# EAGLE design I2C-7313-cTc (EAGLE 7.7.0)

## Sheet 1 of 2
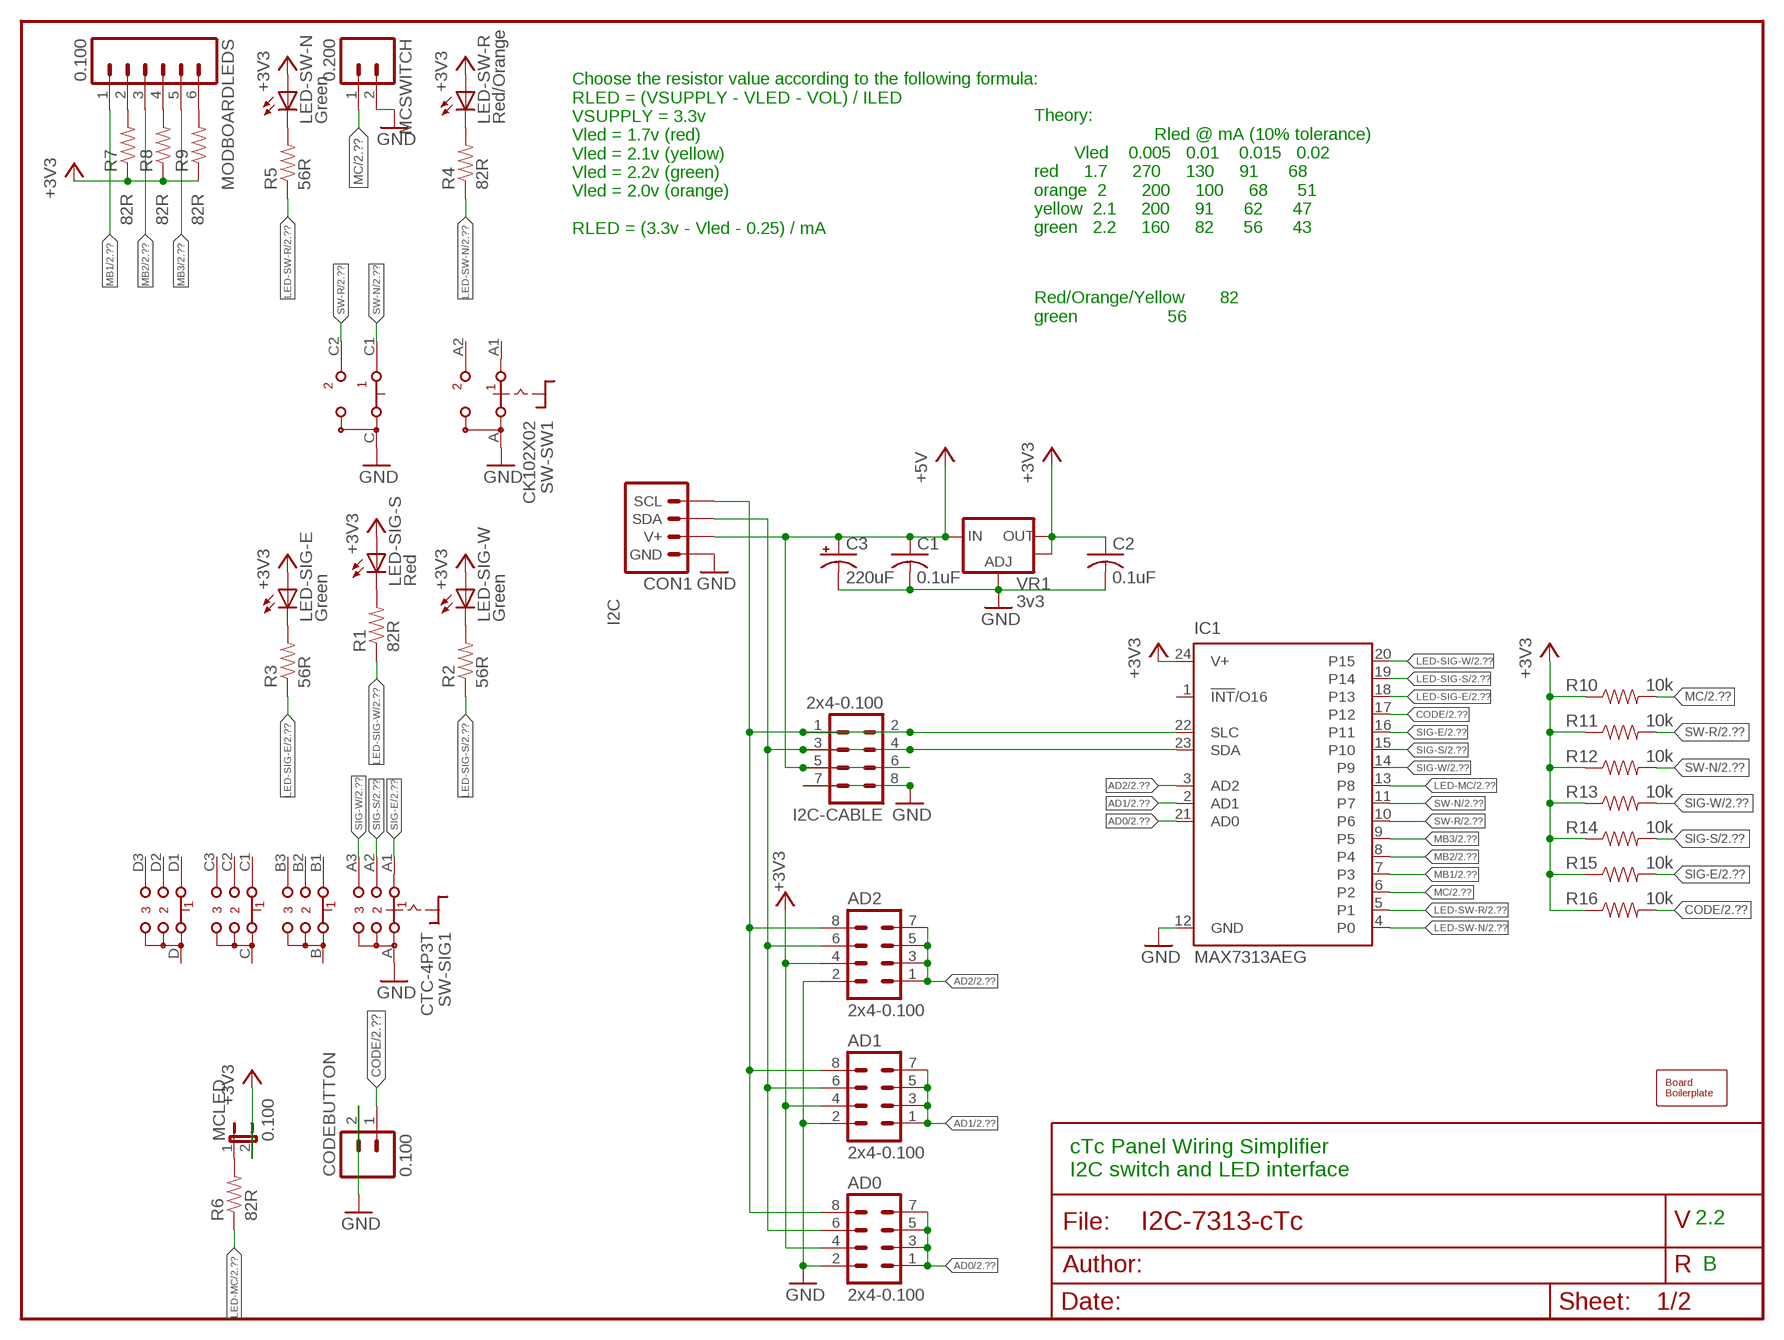
[diagram p0: schematic, sheet 1]

### Parts
AD0  2x4-0.100  MA04-2  [MA04-2]
AD1  2x4-0.100  MA04-2  [MA04-2]
AD2  2x4-0.100  MA04-2  [MA04-2]
BOARD1  BOARD  BOARD100X150X2-NOHOLES  [BOARD-SEEED10X15/2-NOHOLES]
C1  0.1uF  CAP0603  [0603-CAP]
C2  0.1uF  CAP0603  [0603-CAP]
C3  220uF  CAP-POL0810  [0810-CAP]
CODEBUTTON  0.100  CONNECTOR-M021X02-LOCK  [1X02_LOCK]
CON1  I2C  CONNECTOR-I2CLEFT  [I2C-L]
I2C-CABLE  2x4-0.100  MA04-2  [MA04-2]
IC1  MAX7313AEG  [QSOP24]
LED-SIG-E  Green  LEDLED3MM  [LED3MM]
LED-SIG-S  Red  LEDLED3MM  [LED3MM]
LED-SIG-W  Green  LEDLED3MM  [LED3MM]
LED-SW-N  Green  LEDLED3MM  [LED3MM]
LED-SW-R  Red/Orange  LEDLED3MM  [LED3MM]
MCLED  0.100  JUMPER-2PTH_LOCK  [1X02_LOCK]
MCSWITCH  0.200  CONNECTOR-M025MM-LOCK  [SCREWTERMINAL-5MM-2]
MODBOARDLEDS  0.100  CONNECTOR-M06LOCK_LONGPADS  [1X06_LOCK_LONGPADS]
R1  82R  R0603-RES  [0603-RES]
R2  56R  R0603-RES  [0603-RES]
R3  56R  R0603-RES  [0603-RES]
R4  82R  R0603-RES  [0603-RES]
R5  56R  R0603-RES  [0603-RES]
R6  82R  R0603-RES  [0603-RES]
R7  82R  R0603-RES  [0603-RES]
R8  82R  R0603-RES  [0603-RES]
R9  82R  R0603-RES  [0603-RES]
R10  10k  R0603-RES  [0603-RES]
R11  10k  R0603-RES  [0603-RES]
R12  10k  R0603-RES  [0603-RES]
R13  10k  R0603-RES  [0603-RES]
R14  10k  R0603-RES  [0603-RES]
R15  10k  R0603-RES  [0603-RES]
R16  10k  R0603-RES  [0603-RES]
SW-SIG1  CTC-4P3T  [CTC-4P3T]
SW-SW1  CK102X02  [CK102X02]
VR1  3v3  VREG_LM1117SOT223  [SOT223]

### Nets
+3V3: AD0.4 AD1.4 AD2.4 C2.1 IC1.24(V+) LED-SIG-E.A LED-SIG-S.A LED-SIG-W.A LED-SW-N.A LED-SW-R.A MCLED.2 R7.1 R8.1 R9.1 R10.1 R11.1 R12.1 R13.1 R14.1 R15.1 R16.1 VR1.2(OUT) VR1.4(OUT) ; also sheet 2
+5V: C1.1 C3.+ CON1.V+ CON1.V+@1(V+) I2C-CABLE.5 I2C-CABLE.6 VR1.3(IN) ; also sheet 2
AD0: AD0.1 AD0.3 AD0.5 AD0.7 IC1.21(AD0) ; also sheet 2
AD1: AD1.1 AD1.3 AD1.5 AD1.7 IC1.2(AD1) ; also sheet 2
AD2: AD2.1 AD2.3 AD2.5 AD2.7 IC1.3(AD2) ; also sheet 2
CODE: CODEBUTTON.1(A) IC1.17(P12) R16.2 ; also sheet 2
GND: AD0.2 AD1.2 AD2.2 C1.2 C2.2 C3.- CODEBUTTON.2(B) CON1.GND CON1.GND@1(GND) I2C-CABLE.7 I2C-CABLE.8 IC1.12(GND) MCSWITCH.2(B) SW-SIG1.A SW-SW1.A SW-SW1.C VR1.1(ADJ) ; also sheet 2
LED-MC: IC1.13(P8) R6.1 ; also sheet 2
LED-SIG-E: IC1.18(P13) R3.1 ; also sheet 2
LED-SIG-S: IC1.19(P14) R2.1 ; also sheet 2
LED-SIG-W: IC1.20(P15) R1.1 ; also sheet 2
LED-SW-N: IC1.4(P0) R4.1 ; also sheet 2
LED-SW-R: IC1.5(P1) R5.1 ; also sheet 2
MB1: IC1.7(P3) MODBOARDLEDS.1 ; also sheet 2
MB2: IC1.8(P4) MODBOARDLEDS.3 ; also sheet 2
MB3: IC1.9(P5) MODBOARDLEDS.5 ; also sheet 2
MC: IC1.6(P2) MCSWITCH.1(A) R10.2 ; also sheet 2
N$1: MCLED.1 R6.2
N$2: LED-SW-N.K(C) R5.2
N$3: LED-SW-R.K(C) R4.2
N$4: MODBOARDLEDS.2 R7.2
N$5: LED-SIG-E.K(C) R3.2
N$6: MODBOARDLEDS.4 R8.2
N$7: MODBOARDLEDS.6 R9.2
N$8: LED-SIG-W.K(C) R2.2
N$9: LED-SIG-S.K(C) R1.2
SCL: AD0.8 AD1.8 AD2.8 CON1.SCL CON1.SCL@1(SCL) I2C-CABLE.1 I2C-CABLE.2 IC1.22(SLC)
SDA: AD0.6 AD1.6 AD2.6 CON1.SDA CON1.SDA@1(SDA) I2C-CABLE.3 I2C-CABLE.4 IC1.23(SDA)
SIG-E: IC1.16(P11) R15.2 SW-SIG1.A1 ; also sheet 2
SIG-S: IC1.15(P10) R14.2 SW-SIG1.A2 ; also sheet 2
SIG-W: IC1.14(P9) R13.2 SW-SIG1.A3 ; also sheet 2
SW-N: IC1.11(P7) R12.2 SW-SW1.C1 ; also sheet 2
SW-R: IC1.10(P6) R11.2 SW-SW1.C2 ; also sheet 2
Unconnected: IC1.1(!INT!/O16) SW-SIG1.B SW-SIG1.B1 SW-SIG1.B2 SW-SIG1.B3 SW-SIG1.C SW-SIG1.C1 SW-SIG1.C2 SW-SIG1.C3 SW-SIG1.D SW-SIG1.D1 SW-SIG1.D2 SW-SIG1.D3 SW-SW1.A1 SW-SW1.A2

### Notes on the sheet
- Choose the resistor value according to the following formula: 
  RLED = (VSUPPLY - VLED - VOL) / ILED
  VSUPPLY = 3.3v
  Vled = 1.7v (red) 
  Vled = 2.1v (yellow)
  Vled = 2.2v (green)
  Vled = 2.0v (orange)
  
  RLED = (3.3v - Vled - 0.25) / mA
- Theory:
                          Rled @ mA (10% tolerance)     
          Vled    0.005   0.01    0.015   0.02
  red     1.7     270     130     91      68
  orange  2       200     100     68      51
  yellow  2.1     200     91      62      47
  green   2.2     160     82      56      43
- Red/Orange/Yellow       82    
  green                  56
- cTc Panel Wiring Simplifier
  I2C switch and LED interface
- 2.2
- B

## Sheet 2 of 2
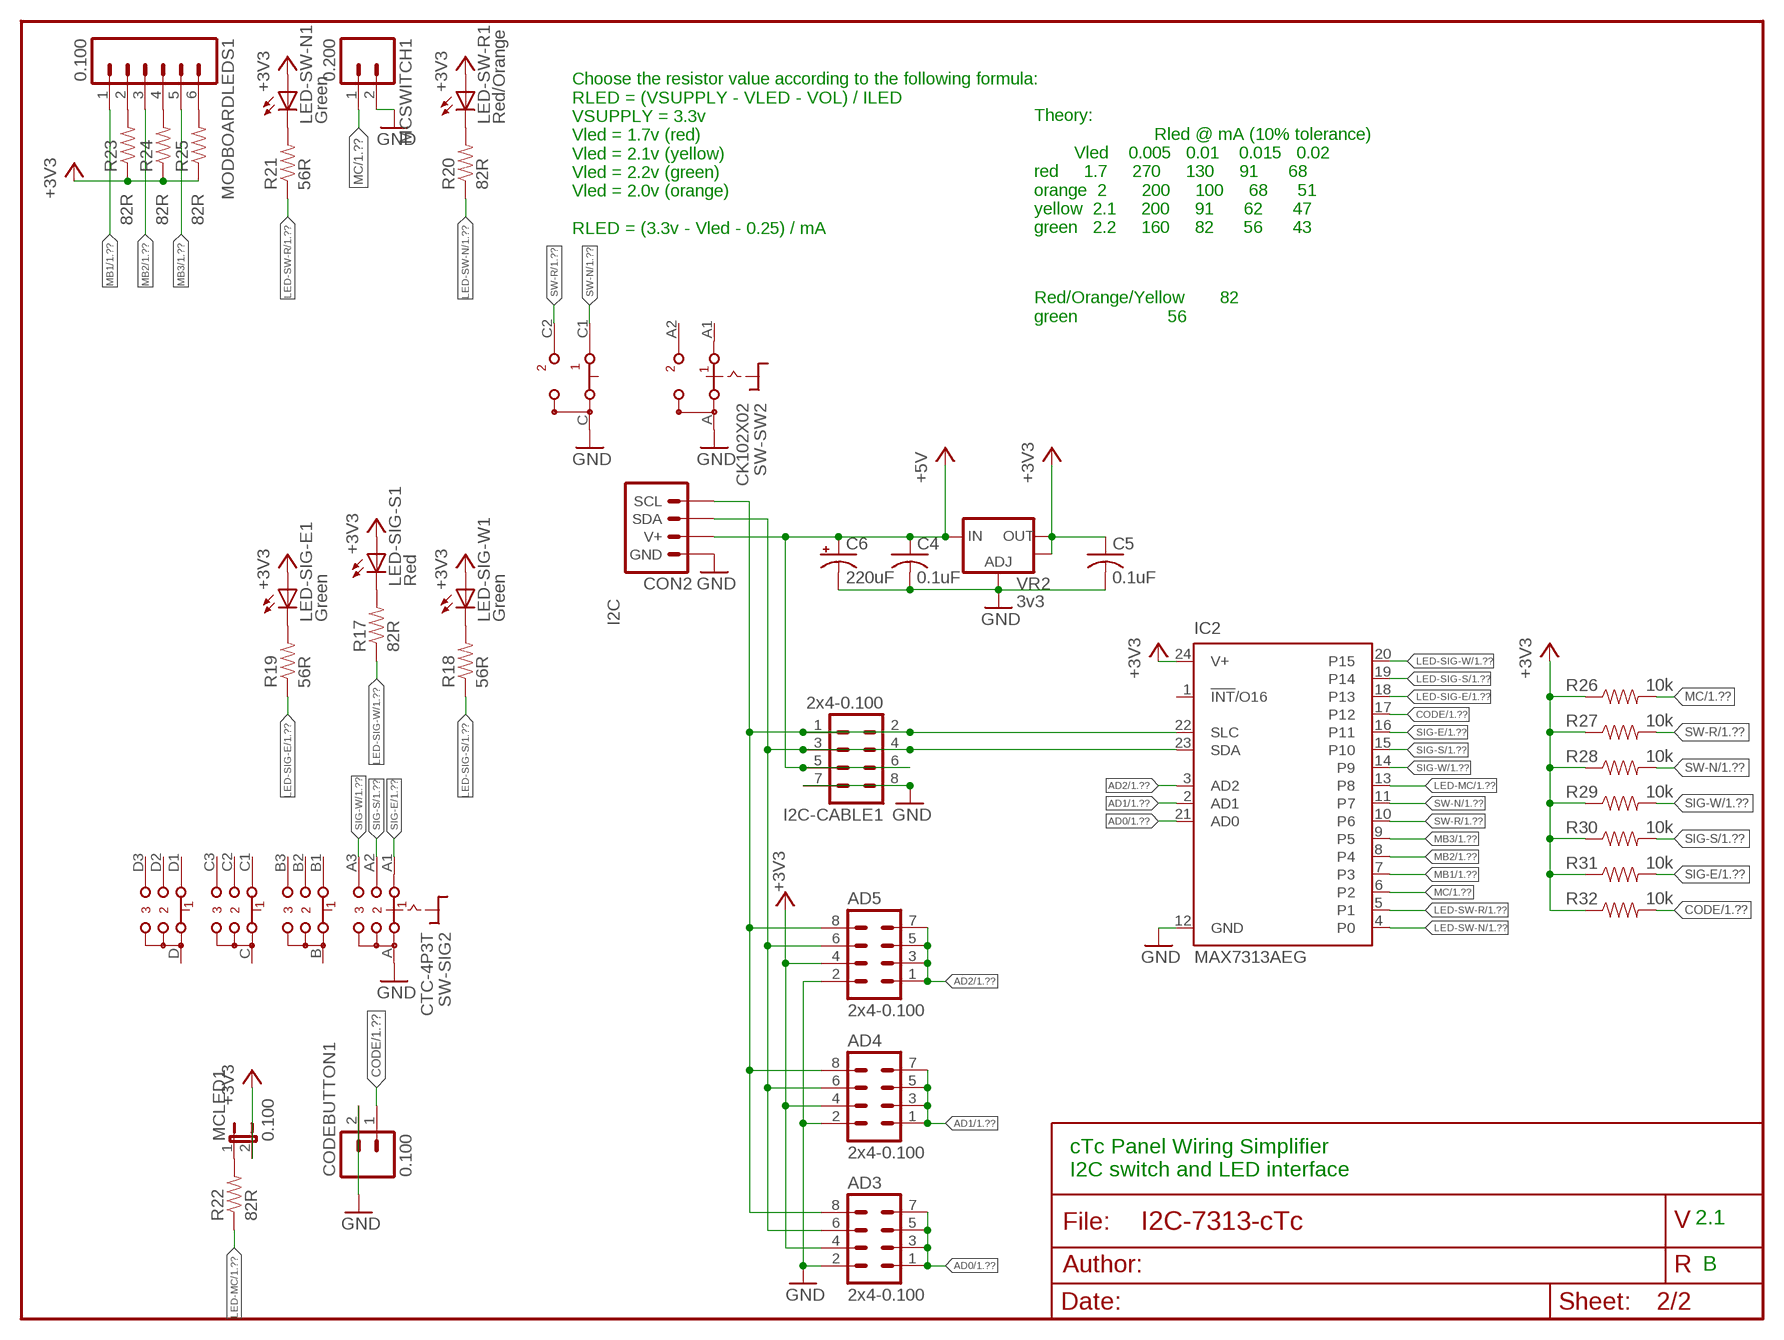
[diagram p1: schematic, sheet 2]

### Parts
AD3  2x4-0.100  MA04-2  [MA04-2]
AD4  2x4-0.100  MA04-2  [MA04-2]
AD5  2x4-0.100  MA04-2  [MA04-2]
C4  0.1uF  CAP0603  [0603-CAP]
C5  0.1uF  CAP0603  [0603-CAP]
C6  220uF  CAP-POL0810  [0810-CAP]
CODEBUTTON1  0.100  CONNECTOR-M021X02-LOCK  [1X02_LOCK]
CON2  I2C  CONNECTOR-I2CLEFT  [I2C-L]
I2C-CABLE1  2x4-0.100  MA04-2  [MA04-2]
IC2  MAX7313AEG  [QSOP24]
LED-SIG-E1  Green  LEDLED3MM  [LED3MM]
LED-SIG-S1  Red  LEDLED3MM  [LED3MM]
LED-SIG-W1  Green  LEDLED3MM  [LED3MM]
LED-SW-N1  Green  LEDLED3MM  [LED3MM]
LED-SW-R1  Red/Orange  LEDLED3MM  [LED3MM]
MCLED1  0.100  JUMPER-2PTH_LOCK  [1X02_LOCK]
MCSWITCH1  0.200  CONNECTOR-M025MM-LOCK  [SCREWTERMINAL-5MM-2]
MODBOARDLEDS1  0.100  CONNECTOR-M06LOCK_LONGPADS  [1X06_LOCK_LONGPADS]
R17  82R  R0603-RES  [0603-RES]
R18  56R  R0603-RES  [0603-RES]
R19  56R  R0603-RES  [0603-RES]
R20  82R  R0603-RES  [0603-RES]
R21  56R  R0603-RES  [0603-RES]
R22  82R  R0603-RES  [0603-RES]
R23  82R  R0603-RES  [0603-RES]
R24  82R  R0603-RES  [0603-RES]
R25  82R  R0603-RES  [0603-RES]
R26  10k  R0603-RES  [0603-RES]
R27  10k  R0603-RES  [0603-RES]
R28  10k  R0603-RES  [0603-RES]
R29  10k  R0603-RES  [0603-RES]
R30  10k  R0603-RES  [0603-RES]
R31  10k  R0603-RES  [0603-RES]
R32  10k  R0603-RES  [0603-RES]
SW-SIG2  CTC-4P3T  [CTC-4P3T]
SW-SW2  CK102X02  [CK102X02]
VR2  3v3  VREG_LM1117SOT223  [SOT223]

### Nets
+3V3: AD3.4 AD4.4 AD5.4 C5.1 IC2.24(V+) LED-SIG-E1.A LED-SIG-S1.A LED-SIG-W1.A LED-SW-N1.A LED-SW-R1.A MCLED1.2 R23.1 R24.1 R25.1 R26.1 R27.1 R28.1 R29.1 R30.1 R31.1 R32.1 VR2.2(OUT) VR2.4(OUT) ; also sheet 1
+5V: C4.1 C6.+ CON2.V+ CON2.V+@1(V+) I2C-CABLE1.5 I2C-CABLE1.6 VR2.3(IN) ; also sheet 1
AD0: AD3.1 AD3.3 AD3.5 AD3.7 IC2.21(AD0) ; also sheet 1
AD1: AD4.1 AD4.3 AD4.5 AD4.7 IC2.2(AD1) ; also sheet 1
AD2: AD5.1 AD5.3 AD5.5 AD5.7 IC2.3(AD2) ; also sheet 1
CODE: CODEBUTTON1.1(A) IC2.17(P12) R32.2 ; also sheet 1
GND: AD3.2 AD4.2 AD5.2 C4.2 C5.2 C6.- CODEBUTTON1.2(B) CON2.GND CON2.GND@1(GND) I2C-CABLE1.7 I2C-CABLE1.8 IC2.12(GND) MCSWITCH1.2(B) SW-SIG2.A SW-SW2.A SW-SW2.C VR2.1(ADJ) ; also sheet 1
LED-MC: IC2.13(P8) R22.1 ; also sheet 1
LED-SIG-E: IC2.18(P13) R19.1 ; also sheet 1
LED-SIG-S: IC2.19(P14) R18.1 ; also sheet 1
LED-SIG-W: IC2.20(P15) R17.1 ; also sheet 1
LED-SW-N: IC2.4(P0) R20.1 ; also sheet 1
LED-SW-R: IC2.5(P1) R21.1 ; also sheet 1
MB1: IC2.7(P3) MODBOARDLEDS1.1 ; also sheet 1
MB2: IC2.8(P4) MODBOARDLEDS1.3 ; also sheet 1
MB3: IC2.9(P5) MODBOARDLEDS1.5 ; also sheet 1
MC: IC2.6(P2) MCSWITCH1.1(A) R26.2 ; also sheet 1
N$10: MCLED1.1 R22.2
N$11: MODBOARDLEDS1.2 R23.2
N$12: MODBOARDLEDS1.4 R24.2
N$13: MODBOARDLEDS1.6 R25.2
N$14: LED-SW-N1.K(C) R21.2
N$15: LED-SW-R1.K(C) R20.2
N$16: LED-SIG-E1.K(C) R19.2
N$17: LED-SIG-W1.K(C) R18.2
N$18: LED-SIG-S1.K(C) R17.2
SCL1: AD3.8 AD4.8 AD5.8 CON2.SCL CON2.SCL@1(SCL) I2C-CABLE1.1 I2C-CABLE1.2 IC2.22(SLC)
SDA1: AD3.6 AD4.6 AD5.6 CON2.SDA CON2.SDA@1(SDA) I2C-CABLE1.3 I2C-CABLE1.4 IC2.23(SDA)
SIG-E: IC2.16(P11) R31.2 SW-SIG2.A1 ; also sheet 1
SIG-S: IC2.15(P10) R30.2 SW-SIG2.A2 ; also sheet 1
SIG-W: IC2.14(P9) R29.2 SW-SIG2.A3 ; also sheet 1
SW-N: IC2.11(P7) R28.2 SW-SW2.C1 ; also sheet 1
SW-R: IC2.10(P6) R27.2 SW-SW2.C2 ; also sheet 1
Unconnected: IC2.1(!INT!/O16) SW-SIG2.B SW-SIG2.B1 SW-SIG2.B2 SW-SIG2.B3 SW-SIG2.C SW-SIG2.C1 SW-SIG2.C2 SW-SIG2.C3 SW-SIG2.D SW-SIG2.D1 SW-SIG2.D2 SW-SIG2.D3 SW-SW2.A1 SW-SW2.A2

### Notes on the sheet
- Choose the resistor value according to the following formula: 
  RLED = (VSUPPLY - VLED - VOL) / ILED
  VSUPPLY = 3.3v
  Vled = 1.7v (red) 
  Vled = 2.1v (yellow)
  Vled = 2.2v (green)
  Vled = 2.0v (orange)
  
  RLED = (3.3v - Vled - 0.25) / mA
- Theory:
                          Rled @ mA (10% tolerance)     
          Vled    0.005   0.01    0.015   0.02
  red     1.7     270     130     91      68
  orange  2       200     100     68      51
  yellow  2.1     200     91      62      47
  green   2.2     160     82      56      43
- Red/Orange/Yellow       82    
  green                  56
- cTc Panel Wiring Simplifier
  I2C switch and LED interface
- 2.1
- B

## Library data of the parts
AD0 AD1-AD5 I2C-CABLE I2C-CABLE1 = con-lstb:MA04-2: PIN HEADER; OC_FARNELL: unknown; OC_NEWARK: unknown
BOARD1 = SPCoast:BOARD
C1 C2 C4 C5 = SPCoast:CAP*
C3 C6 = SPCoast:CAP-POL*
CODEBUTTON CODEBUTTON1 MCSWITCH MCSWITCH1 = SPCoast:CONNECTOR-M02: PHOENIX CONNECTOR
CON1 CON2 = SPCoast:CONNECTOR-I2C
IC1 IC2 = maxim:MAX7313AEG: 16-Port I/O Expander with LED Intensity Control, Interrupt, and Hot-Insertion Protection Source: http://datasheets.maxim-ic.com/en/ds/MAX7313.pdf; MPN: MAX7313AEG+; OC_FARNELL: unknown; OC_NEWARK: 53K7268
LED-SIG-E LED-SIG-E1 LED-SIG-S LED-SIG-S1 LED-SIG-W LED-SIG-W1 LED-SW-N LED-SW-N1 LED-SW-R LED-SW-R1 = SPCoast:LED*
MCLED MCLED1 = SPCoast:JUMPER-2: Jumper Basic 0.1" spaced jumper. Use with breakaway headers.
MODBOARDLEDS MODBOARDLEDS1 = SPCoast:CONNECTOR-M06: Header 6 Standard 6-pin 0.1" header
R1-R32 = SPCoast:R*: Resistor Basic schematic elements and footprints for 0603, 1206, and PTH 1/10th watt (small) resistors.
SW-SIG1 SW-SIG2 = SPCoast:CTC-4P3T: ROTARY SWITCH C&K
SW-SW1 SW-SW2 = SPCoast:CK102X02
VR1 VR2 = SPCoast:VREG_LM1117: Voltage Regulator LM1117 Standard adjustable voltage regulator but in SMD form. Spark Fun Electronics SKU : COM-00595

## Net classes
0 default: clearance 0.203 mm

## Board
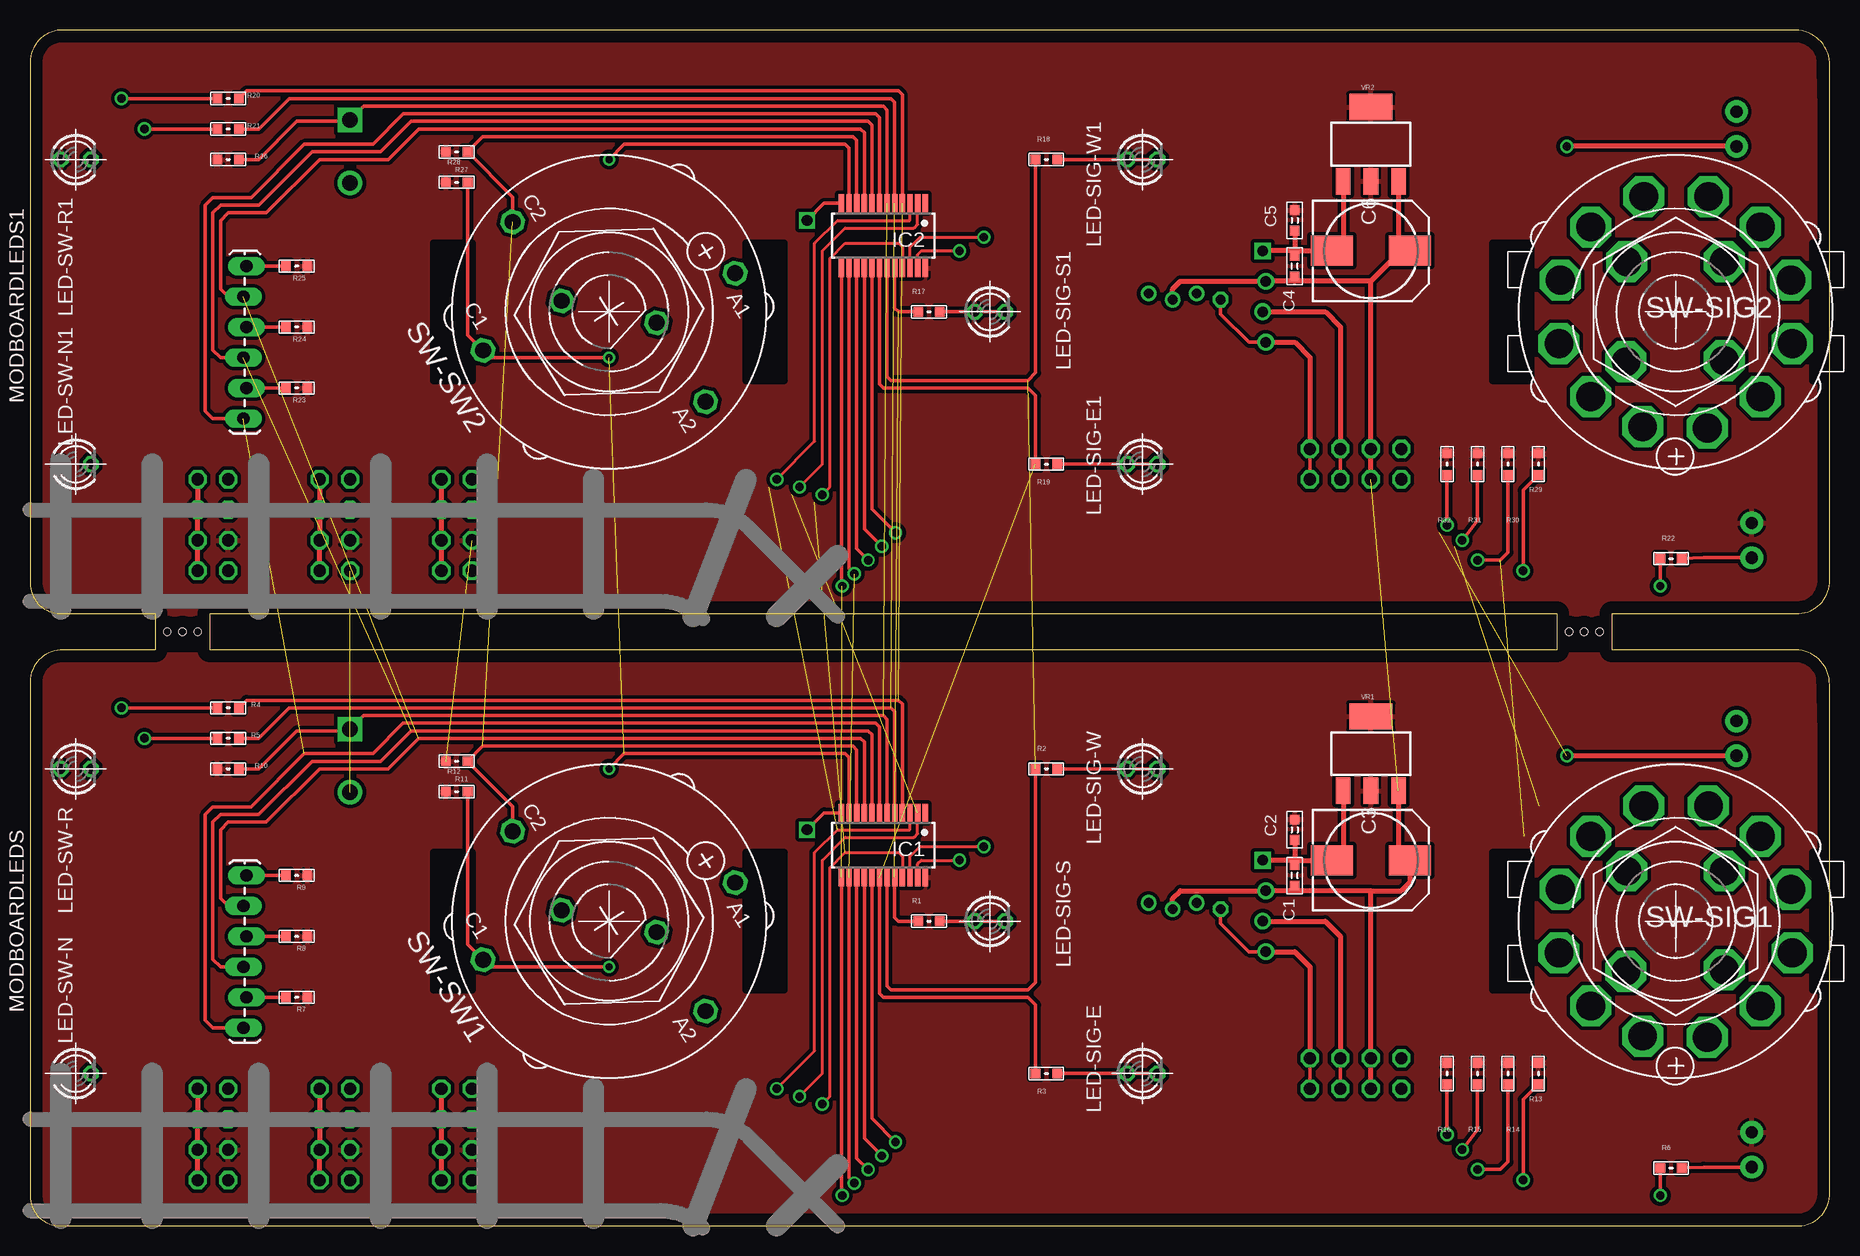
[diagram p2: board, top side]
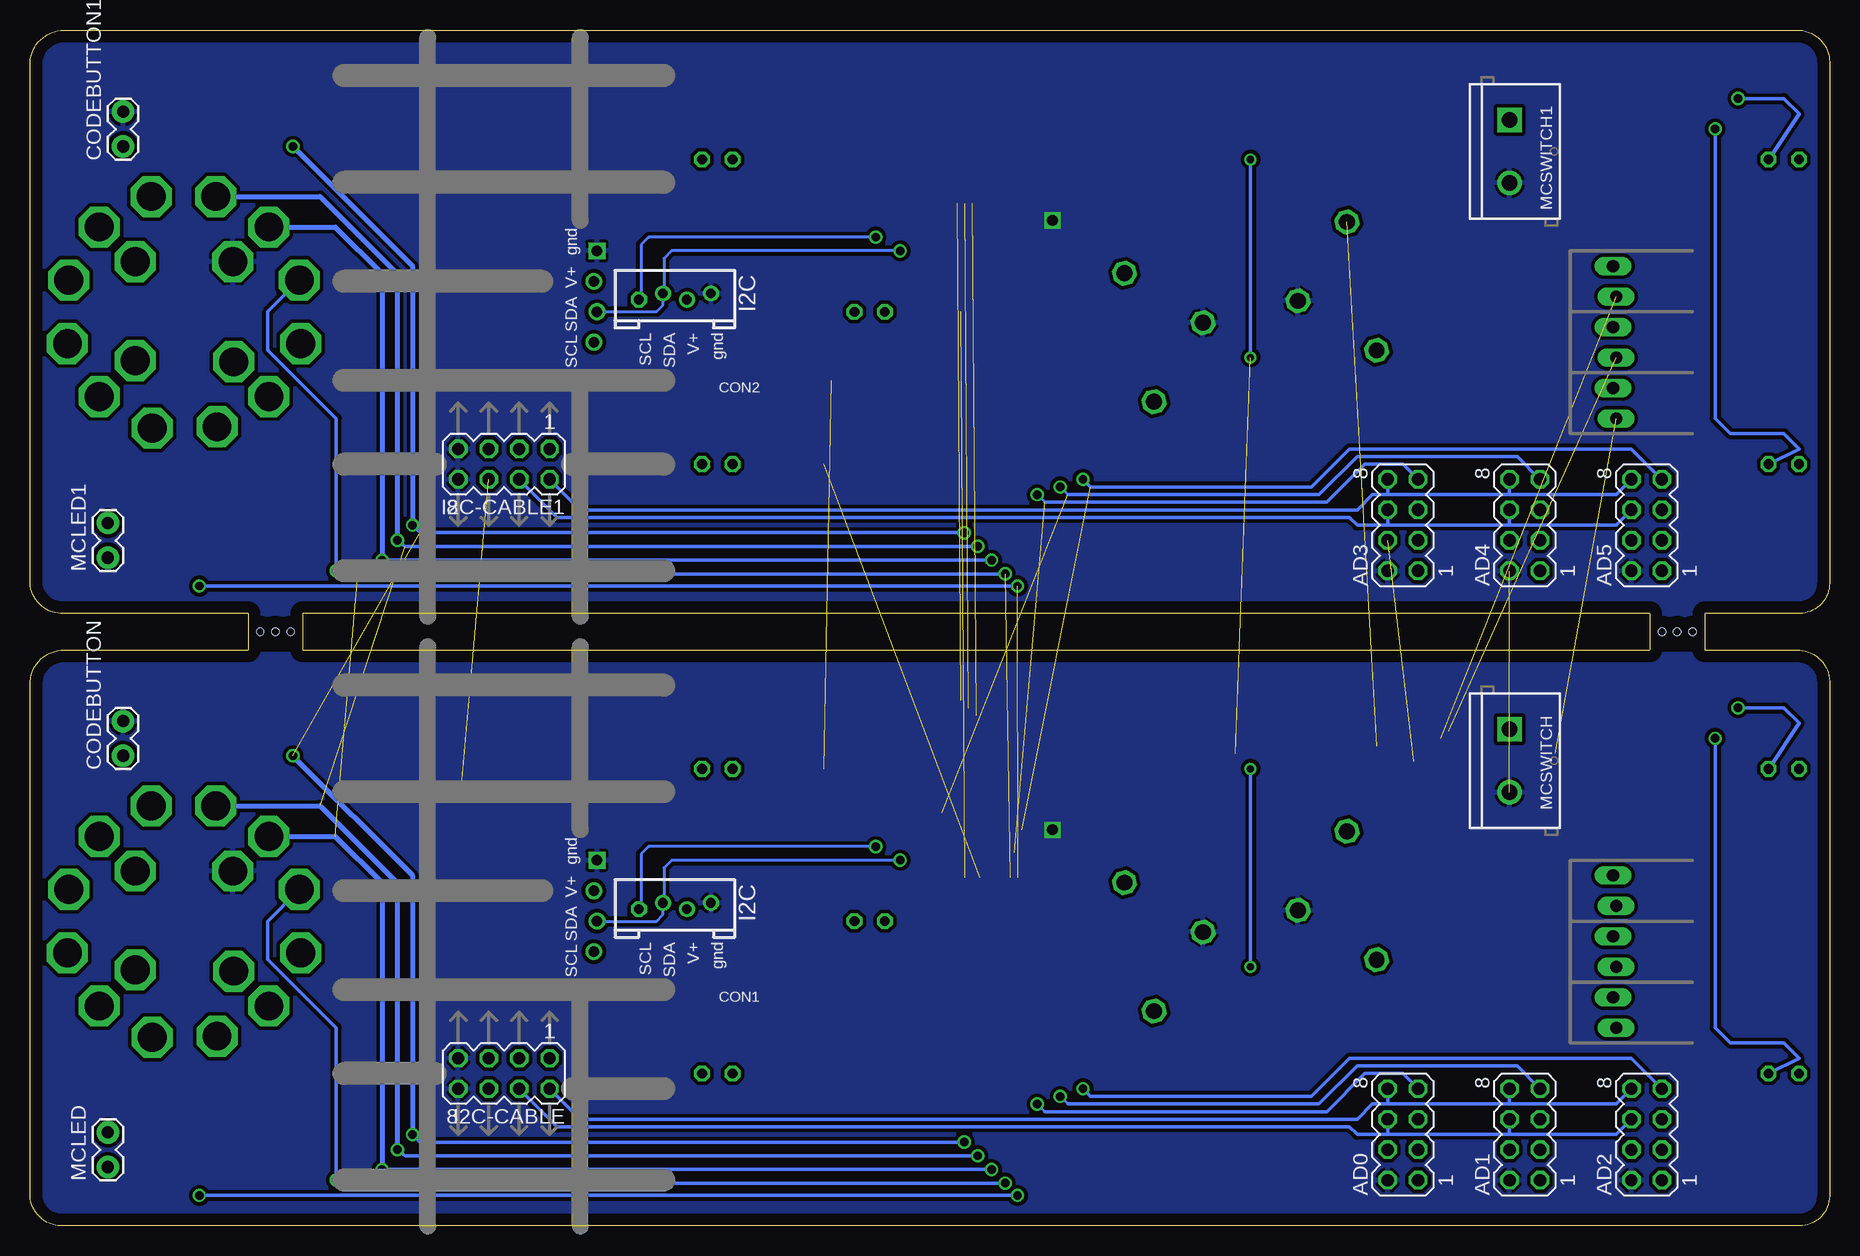
[diagram p3: board, bottom side, seen from below]

Size 150.01 x 99.7 mm. Coordinates in mm from the lower left corner, seen from the top.
Copper layers (1*16): Top 0.035mm / dielectric 1.5mm / Bottom 0.035mm
Design rules "default": minimum track width 10mil, minimum drill 24mil, track to track 8mil, track to pad 8mil, pad to pad 8mil, via to via 8mil, smd to smd 8mil, copper to edge 40mil, drill to drill 8mil, minimum pad ring 10mil, minimum via ring 8mil, stop-mask expansion 4mil, vias tented up to drill 0mil, thermal gap 10mil
tRestrict: area 121.9,19.7 to 125.1,31.1; area 59.7,19.7 to 62.9,31.1; area 33.7,19.7 to 36.8,31.1; area 148.6,19.7 to 151.8,31.1; area 121.9,70.5 to 125.1,81.9; area 59.7,70.5 to 62.9,81.9; area 33.7,70.5 to 36.8,81.9; area 148.6,70.5 to 151.8,81.9

### Footprints (pad centres in the part's own frame; a part is rotated, then mirrored left to right if it is on the bottom)
MA04-2 = drill 1.016 octagon: 1 -3.81,-1.27; 2 -3.81,1.27; 3 -1.27,-1.27; 4 -1.27,1.27; 5 1.27,-1.27; 6 1.27,1.27; 7 3.81,-1.27; 8 3.81,1.27
BOARD-SEEED10X15/2-NOHOLES = hole 0.6: 11.43,49.53; 12.7,49.53; 13.97,49.53; 128.27,49.53; 129.54,49.53; 130.81,49.53
0603-CAP = smd 0.813 x 0.813: 1 -0.85,0; 2 0.85,0
0810-CAP = smd 3.5 x 2.5: + 3.25,0; - -3.25,0
1X02_LOCK = drill 1.016 pad 1.88: 1 -0.178,0; 2 2.718,0
I2C-L = drill 0.9 square: GND 3.81,-0.127 | drill 0.8 pad 1.27: GND@1 0.254,-9.635; SDA@1 0.254,-5.635; V+@1 -0.254,-7.635 | drill 0.9: SCL -3.81,0.127; SDA -1.27,-0.127; V+ 1.27,0.127 | drill 0.8 pad 1.27 octagon: SCL@1 -0.254,-3.635
QSOP24 = smd 0.45 x 1.5: 1 -3.493,-2.69; 2 -2.857,-2.69; 3 -2.223,-2.69; 4 -1.587,-2.69; 5 -0.953,-2.69; 6 -0.318,-2.69; 7 0.318,-2.69; 8 0.953,-2.69; 9 1.587,-2.69; 10 2.223,-2.69; 11 2.857,-2.69; 12 3.493,-2.69; 13 3.493,2.69; 14 2.857,2.69; 15 2.223,2.69; 16 1.587,2.69; 17 0.953,2.69; 18 0.318,2.69; 19 -0.318,2.69; 20 -0.953,2.69; 21 -1.587,2.69; 22 -2.223,2.69; 23 -2.857,2.69; 24 -3.493,2.69
LED3MM = drill 0.813 octagon: A 1.27,0; K -1.27,0
SCREWTERMINAL-5MM-2 = drill 1.3 pad 2.032 square: 1 -0.127,0 | drill 1.3 pad 2.032: 2 5.127,0
1X06_LOCK_LONGPADS = drill 1.016 long: 1 0,0; 2 2.54,-0.254; 3 5.08,0; 4 7.62,-0.254; 5 10.16,0; 6 12.7,-0.254
0603-RES = smd 0.813 x 0.813: 1 -0.9,0; 2 0.9,0
CTC-4P3T = drill 2.4 octagon: A -4.17,-4.07; A1 -9.617,-2.645; A2 -7.072,-7.072; A3 -2.645,-9.617; B -4.17,4.07; B1 -2.645,9.617; B2 -7.072,7.072; B3 -9.617,2.745; C 4.07,4.07; C1 9.682,2.645; C2 7.072,7.072; C3 2.645,9.717; D 4.17,-4.13; D1 2.645,-9.717; D2 7.072,-7.072; D3 9.582,-2.745
CK102X02 = drill 1.321 octagon: A -0.913,-3.955; A1 3.214,-10.511; A2 -7.496,-8.039; C 0.913,3.955; C1 -3.214,10.511; C2 7.496,8.039
SOT223 = smd 1.219 x 2.235: 1 -2.311,-3.099; 2 0,-3.099; 3 2.311,-3.099 | smd 3.6 x 2.2: 4 0,3.099

### Placement (x,y rotation side)
AD0  35.57,7.62 90 bottom
AD1  25.41,7.62 90 bottom
AD2  15.25,7.62 90 bottom
AD3  35.57,58.42 90 bottom
AD4  25.41,58.42 90 bottom
AD5  15.25,58.42 90 bottom
BOARD1  0.01,0 0 top
C1  105.42,29.21 90 top
C2  105.42,33.02 270 top
C3  111.77,30.48 0 top
C4  105.42,80.01 90 top
C5  105.42,83.82 270 top
C6  111.77,81.28 0 top
CODEBUTTON  142.25,39.37 90 bottom
CODEBUTTON1  142.25,90.17 90 bottom
CON1  102.88,26.67 90 bottom
CON2  102.88,77.47 90 bottom
I2C-CABLE  110.5,12.7 180 bottom
I2C-CABLE1  110.5,63.5 180 bottom
IC1  71.13,31.75 180 top
IC2  71.13,82.55 180 top
LED-SIG-E  92.72,12.7 180 top
LED-SIG-E1  92.72,63.5 180 top
LED-SIG-S  80.02,25.4 180 top
LED-SIG-S1  80.02,76.2 180 top
LED-SIG-W  92.72,38.1 180 top
LED-SIG-W1  92.72,88.9 180 top
LED-SW-N  3.82,12.7 180 top
LED-SW-N1  3.82,63.5 180 top
LED-SW-R  3.82,38.1 180 top
LED-SW-R1  3.82,88.9 180 top
MCLED  143.52,5.08 90 bottom
MCLED1  143.52,55.88 90 bottom
MCSWITCH  26.68,41.28 270 bottom
MCSWITCH1  26.68,92.08 270 bottom
MODBOARDLEDS  17.79,16.51 90 top
MODBOARDLEDS1  17.79,67.31 90 top
R1  74.94,25.4 0 top
R2  84.72,38.1 0 top
R3  84.72,12.7 0 top
R4  16.52,43.18 180 top
R5  16.52,40.64 180 top
R6  136.79,4.83 0 top
R7  22.23,19.05 180 top
R8  22.23,24.13 180 top
R9  22.23,29.21 180 top
R10  16.52,38.1 0 top
R11  35.57,38.74 0 top
R12  35.57,36.2 0 top
R13  125.74,12.7 270 top
R14  123.2,12.7 270 top
R15  120.66,12.7 270 top
R16  118.12,12.7 270 top
R17  74.94,76.2 0 top
R18  84.72,88.9 0 top
R19  84.72,63.5 0 top
R20  16.52,93.98 180 top
R21  16.52,91.44 180 top
R22  136.79,55.63 0 top
R23  22.23,69.85 180 top
R24  22.23,74.93 180 top
R25  22.23,80.01 180 top
R26  16.52,88.9 0 top
R27  35.57,89.54 0 top
R28  35.57,87 0 top
R29  125.74,63.5 270 top
R30  123.2,63.5 270 top
R31  120.66,63.5 270 top
R32  118.12,63.5 270 top
SW-SIG1  137.17,25.4 270 top
SW-SIG2  137.17,76.2 270 top
SW-SW1  48.27,25.4 90 top
SW-SW2  48.27,76.2 90 top
VR1  111.77,39.37 0 top
VR2  111.77,90.17 0 top

### Tracks (layer width: path | path; a pad name or v marks a point on that pad's centre or on a via)
+3V3  (1 unrouted)
  pour Top (isolate 0.305): 0.01,47.63 148.6,47.63 149.87,-1.27 0.01,-1.27
  pour Top (isolate 0.305): 0.01,99.7 148.6,99.7 149.87,50.8 0.01,50.8
+5V  (1 unrouted)
  Top 0.406: CON1.V+@1 95.24,27.29 95.89,27.94 CON1.V+ 105.42,27.94 | I2C-CABLE.6 I2C-CABLE.5 111.77,27.94 | 111.77,27.94 105.42,27.94 | C1.1 105.42,27.94 | 111.77,27.94 114.31,27.94 115.02,28.65 C3.+ 114.08,31.42 VR1.3 | CON2.V+@1 95.24,78.09 95.89,78.74 CON2.V+ 105.42,78.74 | I2C-CABLE1.6 I2C-CABLE1.5 111.77,78.74 | 111.77,78.74 105.42,78.74 | C4.1 105.42,78.74 | VR2.3 114.08,81.28 114.31,81.28 | 114.31,81.28 C6.+ | 111.77,78.74 114.31,81.28
AD0  (via drill 0.7)  (1 unrouted)
  Top 0.254: v66.05,10.16 66.68,10.8 66.68,29.85 67.95,31.12 72.4,31.12 72.72,30.8 IC1.21 | v66.05,60.96 66.68,61.6 66.68,80.65 67.95,81.92 72.4,81.92 72.72,81.6 IC2.21
  Top 0.406: AD0.1 AD0.3 AD0.5 AD0.7 | AD3.1 AD3.3 AD3.5 AD3.7
  Bottom 0.254: 65.41,9.53 v66.05,10.16 | 65.41,60.33 v66.05,60.96
  Bottom 0.305: AD0.7 35.57,12.7 38.74,12.7 41.92,9.53 65.41,9.53 | AD3.7 35.57,63.5 38.74,63.5 41.92,60.33 65.41,60.33
AD1  (via drill 0.7)  (1 unrouted)
  Top 0.254: v64.14,10.8 66.05,12.7 66.05,30.48 67.95,32.39 73.67,32.39 73.99,32.71 IC1.2 | v64.14,61.6 66.05,63.5 66.05,81.28 67.95,83.19 73.67,83.19 73.99,83.51 IC2.2
  Top 0.406: AD1.7 AD1.5 AD1.3 AD1.1 | AD4.7 AD4.5 AD4.3 AD4.1
  Bottom 0.254: 63.51,10.16 v64.14,10.8 | 63.51,60.96 v64.14,61.6
  Bottom 0.305: AD1.7 26.04,13.34 39.38,13.34 42.55,10.16 63.51,10.16 | AD4.7 26.04,64.14 39.38,64.14 42.55,60.96 63.51,60.96
AD2  (via drill 0.7)  (1 unrouted)
  Top 0.254: v62.24,11.43 65.41,14.61 65.41,31.12 67.32,33.02 73.35,33.02 IC1.3 | v62.24,62.23 65.41,65.41 65.41,81.92 67.32,83.82 73.35,83.82 IC2.3
  Top 0.406: AD2.1 AD2.3 AD2.5 AD2.7 | AD5.1 AD5.3 AD5.5 AD5.7
  Bottom 0.305: AD2.7 16.52,13.97 40.01,13.97 43.19,10.8 61.6,10.8 v62.24,11.43 | AD5.7 16.52,64.77 40.01,64.77 43.19,61.6 61.6,61.6 v62.24,62.23
CODE  (via drill 0.7)  (1 unrouted)
  Top 0.305: IC1.17 70.18,8.96 v72.15,6.99 | R16.2 v118.12,7.62 | IC2.17 70.18,59.76 v72.15,57.79 | R32.2 v118.12,58.42
  Top 0.406: CODEBUTTON.1 v128.1,39.2 | CODEBUTTON1.1 v128.1,90
  Bottom 0.305: v118.12,7.62 117.48,6.99 v72.15,6.99 | v118.12,58.42 117.48,57.79 v72.15,57.79
  Bottom 0.406: v128.1,39.2 118.12,29.21 v118.12,7.62 | v128.1,90 118.12,80.01 v118.12,58.42
GND  (via drill 0.9)  (1 unrouted)
  Top 0.305: v64.78,33.02 66.2,34.44 IC1.12 | v64.78,83.82 66.2,85.24 IC2.12
  Top 0.406: 105.42,30.48 CON1.GND | C2.2 105.42,30.48 | 105.42,30.48 C1.2 | 105.42,81.28 CON2.GND | C5.2 105.42,81.28 | 105.42,81.28 C4.2 | 105.42,81.28 C6.- 109.46,81.28 VR2.1 | 105.42,30.48 C3.- 109.23,30.48 109.46,30.71 VR1.1
  pour Bottom (isolate 0.305): 0.01,47.63 149.87,47.63 149.87,-1.27 0.01,-1.27
  pour Bottom (isolate 0.305): 0.01,99.7 149.87,99.7 149.87,50.8 0.01,50.8
LED-MC  (via drill 0.7)  (1 unrouted)
  Top 0.305: R6.1 v135.9,2.54 | IC1.13 67.64,2.61 v67.7,2.54 | R22.1 v135.9,53.34 | IC2.13 67.64,53.41 v67.7,53.34
  Bottom 0.305: v135.9,2.54 v67.7,2.54 | v135.9,53.34 v67.7,53.34
LED-SIG-E  (1 unrouted)
  Top 0.305: IC1.18 70.81,19.37 71.13,19.05 83.19,19.05 83.83,18.42 R3.1 | IC2.18 70.81,70.17 71.13,69.85 83.19,69.85 83.83,69.22 R19.1
LED-SIG-S  (1 unrouted)
  Top 0.305: IC1.19 71.45,20.01 71.76,19.69 83.19,19.69 83.83,20.32 R2.1 | IC2.19 71.45,70.81 71.76,70.49 83.19,70.49 83.83,71.12 R18.1
LED-SIG-W  (1 unrouted)
  Top 0.305: R1.1 72.4,25.4 72.08,25.72 IC1.20 | R17.1 72.4,76.2 72.08,76.52 IC2.20
LED-SW-N  (1 unrouted)
  Top 0.305: R4.1 18.05,43.82 72.4,43.82 72.72,43.5 IC1.4 | R20.1 18.05,94.62 72.4,94.62 72.72,94.3 IC2.4
LED-SW-R  (1 unrouted)
  Top 0.305: R5.1 19.06,40.64 21.6,43.18 71.76,43.18 72.08,42.87 IC1.5 | R21.1 19.06,91.44 21.6,93.98 71.76,93.98 72.08,93.67 IC2.5
MB1  (1 unrouted)
  Top 0.305: MODBOARDLEDS.1 15.25,16.51 14.61,17.15 14.61,34.29 15.25,34.93 18.42,34.93 22.87,39.37 28.58,39.37 31.12,41.91 70.49,41.91 70.81,41.6 IC1.7 | MODBOARDLEDS1.1 15.25,67.31 14.61,67.95 14.61,85.09 15.25,85.73 18.42,85.73 22.87,90.17 28.58,90.17 31.12,92.71 70.49,92.71 70.81,92.4 IC2.7
MB2  (1 unrouted)
  Top 0.305: MODBOARDLEDS.3 15.88,21.59 15.25,22.23 15.25,33.66 15.88,34.29 19.06,34.29 23.5,38.74 29.22,38.74 31.76,41.28 69.86,41.28 70.18,40.96 IC1.8 | MODBOARDLEDS1.3 15.88,72.39 15.25,73.03 15.25,84.46 15.88,85.09 19.06,85.09 23.5,89.54 29.22,89.54 31.76,92.08 69.86,92.08 70.18,91.76 IC2.8
MB3  (1 unrouted)
  Top 0.305: MODBOARDLEDS.5 16.52,26.67 15.88,27.31 15.88,33.02 16.52,33.66 19.69,33.66 24.14,38.1 29.85,38.1 32.39,40.64 69.22,40.64 69.54,40.33 IC1.9 | MODBOARDLEDS1.5 16.52,77.47 15.88,78.11 15.88,83.82 16.52,84.46 19.69,84.46 24.14,88.9 29.85,88.9 32.39,91.44 69.22,91.44 69.54,91.13 IC2.9
MC  (1 unrouted)
  Top 0.305: IC1.6 71.45,42.23 71.13,42.55 27.82,42.55 MCSWITCH.1 26.55,41.28 22.23,41.28 19.06,38.1 R10.2 | IC2.6 71.45,93.03 71.13,93.35 27.82,93.35 MCSWITCH1.1 26.55,92.08 22.23,92.08 19.06,88.9 R26.2
N$1
  Top 0.305: R6.2 139.52,4.91 MCLED.1
N$2  (via drill 0.7)
  Top 0.305: R5.2 v9.53,40.64
  Bottom 0.305: v9.53,40.64 9.53,16.51 8.26,15.24 3.82,15.24 2.55,13.97 LED-SW-N.K
N$3  (via drill 0.7)
  Top 0.305: R4.2 v7.63,43.18
  Bottom 0.305: v7.63,43.18 3.82,43.18 2.55,41.91 LED-SW-R.K
N$4
  Top 0.305: MODBOARDLEDS.2 R7.2
N$5
  Top 0.305: R3.2 LED-SIG-E.K
N$6
  Top 0.305: MODBOARDLEDS.4 R8.2
N$7
  Top 0.305: MODBOARDLEDS.6 R9.2
N$8
  Top 0.305: R2.2 LED-SIG-W.K
N$9
  Top 0.305: R1.2 LED-SIG-S.K
N$10
  Top 0.305: R22.2 139.52,55.71 MCLED1.1
N$11
  Top 0.305: MODBOARDLEDS1.2 R23.2
N$12
  Top 0.305: MODBOARDLEDS1.4 R24.2
N$13
  Top 0.305: MODBOARDLEDS1.6 R25.2
N$14  (via drill 0.7)
  Top 0.305: R21.2 v9.53,91.44
  Bottom 0.305: v9.53,91.44 9.53,67.31 8.26,66.04 3.82,66.04 2.55,64.77 LED-SW-N1.K
N$15  (via drill 0.7)
  Top 0.305: R20.2 v7.63,93.98
  Bottom 0.305: v7.63,93.98 3.82,93.98 2.55,92.71 LED-SW-R1.K
N$16
  Top 0.305: R19.2 LED-SIG-E1.K
N$17
  Top 0.305: R18.2 LED-SIG-W1.K
N$18
  Top 0.305: R17.2 LED-SIG-S1.K
SCL  (via drill 0.7)
  Top 0.254: IC1.22 73.35,30.8 74.18,31.63 v79.51,31.63
  Top 0.305: I2C-CABLE.1 I2C-CABLE.2 | CON1.SCL@1 99.24,25.23 101.61,22.86 CON1.SCL
  Top 0.406: CON1.SCL 105.42,22.86 106.69,21.59 I2C-CABLE.1
  Bottom 0.254: v79.51,31.63 98.43,31.63 99.07,30.99 99.07,26.85 CON1.SCL@1
  Bottom 0.305: 26.68,10.16 17.79,10.16 AD2.8 | 26.68,10.16 36.84,10.16 | AD1.8 26.68,10.16 | AD0.8 36.84,10.16 | I2C-CABLE.2 104.15,8.89 39.38,8.89 38.11,10.16 36.84,10.16
SCL1  (via drill 0.7)
  Top 0.254: IC2.22 73.35,81.6 74.18,82.43 v79.51,82.43
  Top 0.305: I2C-CABLE1.1 I2C-CABLE1.2 | CON2.SCL@1 99.24,76.03 101.61,73.66 CON2.SCL
  Top 0.406: CON2.SCL 105.42,73.66 106.69,72.39 I2C-CABLE1.1
  Bottom 0.254: v79.51,82.43 98.43,82.43 99.07,81.79 99.07,77.65 CON2.SCL@1
  Bottom 0.305: 26.68,60.96 17.79,60.96 AD5.8 | 26.68,60.96 36.84,60.96 | AD4.8 26.68,60.96 | AD3.8 36.84,60.96 | I2C-CABLE1.2 104.15,59.69 39.38,59.69 38.11,60.96 36.84,60.96
SDA  (via drill 0.7)
  Top 0.254: IC1.23 73.99,30.17 74.3,30.48 v77.48,30.48
  Top 0.305: I2C-CABLE.3 I2C-CABLE.4
  Top 0.406: CON1.SDA 107.96,25.4 109.23,24.13 I2C-CABLE.3
  Bottom 0.254: v77.48,30.48 96.53,30.48 97.16,29.85 97.16,26.75 CON1.SDA@1 97.24,25.96 97.8,25.4 CON1.SDA
  Bottom 0.305: 26.68,7.62 17.79,7.62 AD2.6 | 26.68,7.62 36.84,7.62 | AD1.6 26.68,7.62 | AD0.6 36.84,7.62 | 36.84,7.62 39.38,7.62 40.01,8.26 106.05,8.26 I2C-CABLE.4
SDA1  (via drill 0.7)
  Top 0.254: IC2.23 73.99,80.97 74.3,81.28 v77.48,81.28
  Top 0.305: I2C-CABLE1.3 I2C-CABLE1.4
  Top 0.406: CON2.SDA 107.96,76.2 109.23,74.93 I2C-CABLE1.3
  Bottom 0.254: v77.48,81.28 96.53,81.28 97.16,80.65 97.16,77.55 CON2.SDA@1 97.24,76.76 97.8,76.2 CON2.SDA
  Bottom 0.305: 26.68,58.42 17.79,58.42 AD5.6 | 26.68,58.42 36.84,58.42 | AD4.6 26.68,58.42 | AD3.6 36.84,58.42 | 36.84,58.42 39.38,58.42 40.01,59.06 106.05,59.06 I2C-CABLE1.4
SIG-E  (via drill 0.7)  (1 unrouted)
  Top 0.305: IC1.16 69.54,7.31 v71,5.85 | R15.2 120.66,7.99 v119.39,6.35 | IC2.16 69.54,58.11 v71,56.65 | R31.2 120.66,58.79 v119.39,57.15
  Bottom 0.305: v119.39,6.35 118.75,5.85 v71,5.85 | v119.39,57.15 118.75,56.65 v71,56.65
  Bottom 0.406: SW-SIG1.A1 125.83,35.02 119.39,28.58 v119.39,6.35 | SW-SIG2.A1 125.83,85.82 119.39,79.38 v119.39,57.15
SIG-S  (via drill 0.7)  (1 unrouted)
  Top 0.305: IC1.15 68.91,5.66 v69.86,4.7 | v120.66,4.7 122.56,4.7 123.2,5.34 R14.2 | IC2.15 68.91,56.46 v69.86,55.5 | v120.66,55.5 122.56,55.5 123.2,56.14 R30.2
  Bottom 0.305: v120.66,4.7 v69.86,4.7 | v120.66,55.5 v69.86,55.5
  Bottom 0.406: SW-SIG1.A2 124.56,32.48 120.66,28.58 v120.66,4.7 | SW-SIG2.A2 124.56,83.28 120.66,79.38 v120.66,55.5
SIG-W  (via drill 0.7)  (1 unrouted)
  Top 0.305: IC1.14 68.27,4 v68.72,3.56 | R13.2 124.47,10.53 v124.47,3.81 | IC2.14 68.27,54.8 v68.72,54.36 | R29.2 124.47,61.33 v124.47,54.61
  Bottom 0.305: v68.72,3.56 124.22,3.56 v124.47,3.81 124.47,16.51 130.18,22.23 130.18,25.4 SW-SIG1.A3 | v68.72,54.36 124.22,54.36 v124.47,54.61 124.47,67.31 130.18,73.03 130.18,76.2 SW-SIG2.A3
SW-N  (via drill 0.6)  (1 unrouted)
  Top 0.305: IC1.11 68.27,39.06 67.95,39.37 49.54,39.37 v48.27,38.1 | IC2.11 68.27,89.86 67.95,90.17 49.54,90.17 v48.27,88.9 | v48.27,72.39 38.35,72.39 SW-SW2.C1 36.47,74.28 R28.2 | v48.27,21.59 38.35,21.59 SW-SW1.C1 36.47,23.48 R12.2
  Bottom 0.305: v48.27,88.9 v48.27,72.39 | v48.27,38.1 v48.27,21.59
SW-R  (1 unrouted)
  Top 0.305: IC1.10 68.91,39.69 68.59,40.01 37.74,40.01 R11.2 40.23,34.98 SW-SW1.C2 | IC2.10 68.91,90.49 68.59,90.81 37.74,90.81 R27.2 40.23,85.78 SW-SW2.C2

### Text on the board
tDocu: cTc harness | SPCoast | John Plocher | www.SPCoast.com | Made in the PCR, Coast Division, NMRA | Model Railroading is Fun! | cTc harness | SPCoast | John Plocher | www.SPCoast.com | Made in the PCR, Coast Division, NMRA | Model Railroading is Fun!
bDocu: CODE / SWITCH | Maintainer / CALL / Switch | cTc Panel Harness | SPCoast | John Plocher | 2016.05 / 2017.11 / 2020.11 | MB3 | + -- | MB2 | + -- | MB1 | + -- | v2.2 | A2 | A1 | A0 | MC LED | + | SCL | SDA | I2C & Power | VCC | C D + - | GND | - | CODE / SWITCH | Maintainer / CALL / Switch | cTc Panel Harness | SPCoast | John Plocher | 2016.05 / 2017.11 / 2020.11 | MB3 | + -- | MB2 | + -- | MB1 | + -- | v2.2 | A2 | A1 | A0 | MC LED | + | SCL | SDA | I2C & Power | VCC | C D + - | GND | -